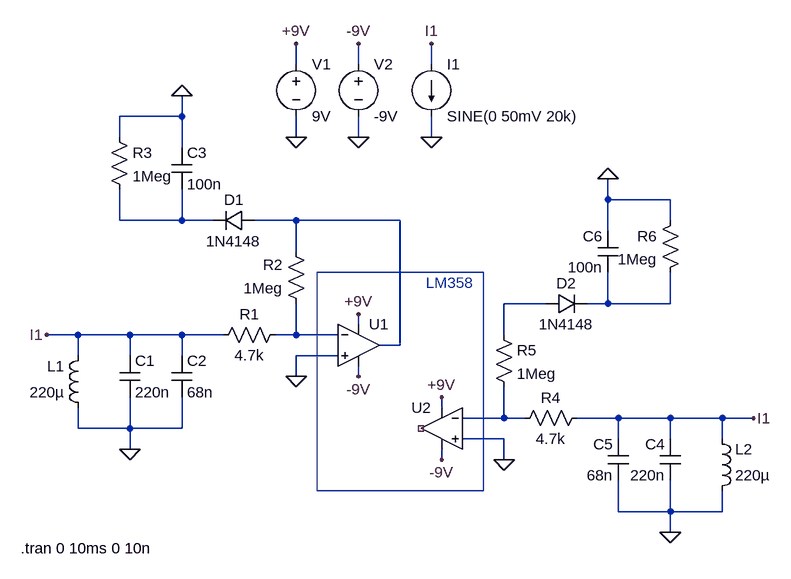
[diagram p0: schematic 20260317-mouseRace-pickupcoilsimulation-v1.asc]
20260317-mouseRace-pickupcoilsimulation-v1.asc, the LTspice schematic file:
Version 4.1
SHEET 1 880 680
WIRE 0 -256 0 -288
WIRE 96 -256 96 -288
WIRE 208 -256 208 -288
WIRE -176 -176 -176 -208
WIRE -176 -176 -272 -176
WIRE -272 -144 -272 -176
WIRE 0 -144 0 -176
WIRE 96 -144 96 -176
WIRE 208 -144 208 -176
WIRE -176 -128 -176 -176
WIRE 480 -48 480 -80
WIRE 576 -48 480 -48
WIRE -272 -16 -272 -64
WIRE -176 -16 -176 -64
WIRE -176 -16 -272 -16
WIRE -128 -16 -176 -16
WIRE 0 -16 -64 -16
WIRE 160 -16 0 -16
WIRE 576 -16 576 -48
WIRE 480 0 480 -48
WIRE 0 32 0 -16
WIRE 384 112 320 112
WIRE 480 112 480 64
WIRE 480 112 448 112
WIRE 576 112 576 64
WIRE 576 112 480 112
WIRE 96 144 96 128
WIRE -336 160 -384 160
WIRE -256 160 -336 160
WIRE -176 160 -256 160
WIRE -112 160 -176 160
WIRE 0 160 0 112
WIRE 0 160 -32 160
WIRE 64 160 0 160
WIRE 320 160 320 112
WIRE 160 176 160 -16
WIRE 160 176 128 176
WIRE -336 192 -336 160
WIRE -256 192 -256 160
WIRE -176 192 -176 160
WIRE 64 192 0 192
WIRE 0 224 0 192
WIRE 96 224 96 208
WIRE 224 272 224 256
WIRE 320 288 320 240
WIRE 320 288 256 288
WIRE 352 288 320 288
WIRE 496 288 432 288
WIRE 576 288 496 288
WIRE 656 288 576 288
WIRE 704 288 656 288
WIRE -336 304 -336 272
WIRE -256 304 -256 256
WIRE -256 304 -336 304
WIRE -176 304 -176 256
WIRE -176 304 -256 304
WIRE 320 320 256 320
WIRE 496 320 496 288
WIRE 576 320 576 288
WIRE 656 320 656 288
WIRE -256 336 -256 304
WIRE 224 352 224 336
WIRE 320 352 320 320
WIRE 496 432 496 384
WIRE 576 432 576 384
WIRE 576 432 496 432
WIRE 656 432 656 400
WIRE 656 432 576 432
WIRE 576 464 576 432
FLAG 0 -144 0
FLAG 96 -144 0
FLAG 0 -288 +9V
FLAG 96 -288 -9V
FLAG 96 128 +9V
FLAG 224 256 +9V
FLAG 96 224 -9V
FLAG 224 352 -9V
FLAG -256 336 0
FLAG 0 224 0
FLAG -176 -208 0
FLAG 320 352 0
FLAG 576 464 0
FLAG 480 -80 0
FLAG 208 -144 0
FLAG 208 -288 I1
FLAG -384 160 I1
FLAG 704 288 I1
SYMBOL voltage 0 -272 R0
SYMATTR InstName V1
SYMATTR Value 9V
SYMBOL voltage 96 -272 R0
SYMATTR InstName V2
SYMATTR Value -9V
SYMBOL ind -320 288 R180
WINDOW 0 36 80 Left 2
WINDOW 3 36 40 Left 2
SYMATTR InstName L1
SYMATTR Value 220µ
SYMATTR SpiceLine Rser=1m
SYMBOL cap -272 192 R0
SYMATTR InstName C1
SYMATTR Value 220n
SYMBOL cap -192 192 R0
SYMATTR InstName C2
SYMATTR Value 68n
SYMBOL res -16 144 R90
WINDOW 0 0 56 VBottom 2
WINDOW 3 32 56 VTop 2
SYMATTR InstName R1
SYMATTR Value 4.7k
SYMBOL res 16 128 R180
WINDOW 0 36 76 Left 2
WINDOW 3 36 40 Left 2
SYMATTR InstName R2
SYMATTR Value 1Meg
SYMBOL diode -64 -32 R90
WINDOW 0 0 32 VBottom 2
WINDOW 3 32 32 VTop 2
SYMATTR InstName D1
SYMATTR Value 1N4148
SYMBOL cap -192 -128 R0
SYMATTR InstName C3
SYMATTR Value 100n
SYMBOL res -288 -160 R0
SYMATTR InstName R3
SYMATTR Value 1Meg
SYMBOL ind 640 416 M180
WINDOW 0 36 80 Left 2
WINDOW 3 36 40 Left 2
SYMATTR InstName L2
SYMATTR Value 220µ
SYMATTR SpiceLine Rser=1m
SYMBOL cap 592 320 M0
SYMATTR InstName C4
SYMATTR Value 220n
SYMBOL cap 512 320 M0
SYMATTR InstName C5
SYMATTR Value 68n
SYMBOL res 448 272 R90
WINDOW 0 0 56 VBottom 2
WINDOW 3 32 56 VTop 2
SYMATTR InstName R4
SYMATTR Value 4.7k
SYMBOL res 304 144 R0
SYMATTR InstName R5
SYMATTR Value 1Meg
SYMBOL diode 384 128 R270
WINDOW 0 32 32 VTop 2
WINDOW 3 0 32 VBottom 2
SYMATTR InstName D2
SYMATTR Value 1N4148
SYMBOL cap 496 0 M0
SYMATTR InstName C6
SYMATTR Value 100n
SYMBOL res 592 -32 M0
SYMATTR InstName R6
SYMATTR Value 1Meg
SYMBOL current 208 -256 R0
WINDOW 123 0 0 Left 0
WINDOW 39 0 0 Left 0
SYMATTR InstName I1
SYMATTR Value SINE(0 50mV 20k)
SYMBOL OpAmps\\UniversalOpAmp2 96 176 R0
SYMATTR InstName U1
SYMBOL OpAmps\\UniversalOpAmp2 224 304 M0
SYMATTR InstName U2
TEXT -424 488 Left 2 !.tran 0 10ms 0 10n
TEXT 200 80 Left 2 ;LM358
RECTANGLE Normal 288 400 32 64

The netlist it stands for:
* 20260317-mouseRace-pickupcoilsimulation-v1.asc
V1 +9V 0 9V
V2 -9V 0 -9V
L1 0 I1 220µ Rser=1m
C1 I1 0 220n
C2 I1 0 68n
R1 N005 I1 4.7k
R2 N005 N002 1Meg
D1 N002 N001 1N4148
C3 0 N001 100n
R3 0 N001 1Meg
L2 0 I1 220µ Rser=1m
C4 I1 0 220n
C5 I1 0 68n
R4 I1 N006 4.7k
R5 N003 N006 1Meg
D2 N003 N004 1N4148
C6 0 N004 100n
R6 0 N004 1Meg
I1 I1 0 SINE(0 50mV 20k)
X§U1 0 N005 +9V -9V N002 level2 Avol=1Meg GBW=10Meg Slew=10Meg Ilimit=25m Rail=0 Vos=0 En=0 Enk=0 In=0 Ink=0 Rin=500Meg  ; pins In+ In- V+ V- OUT
X§U2 0 N006 +9V -9V NC_01 level2 Avol=1Meg GBW=10Meg Slew=10Meg Ilimit=25m Rail=0 Vos=0 En=0 Enk=0 In=0 Ink=0 Rin=500Meg  ; pins In+ In- V+ V- OUT
.model D D
.lib standard.dio
.tran 0 10ms 0 10n
* LM358
.lib UniversalOpAmp2.lib
.backanno
.end